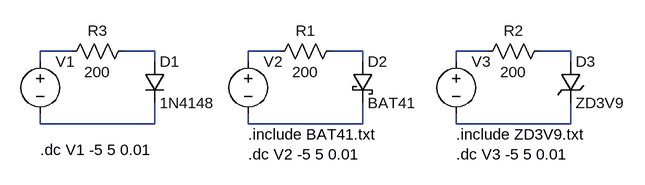
[diagram p0: schematic 121_BAT41.asc]
121_BAT41.asc, the LTspice schematic file:
Version 4
SHEET 1 880 680
WIRE -128 176 -176 176
WIRE 0 176 -48 176
WIRE 192 176 144 176
WIRE 320 176 272 176
WIRE 512 176 464 176
WIRE 640 176 592 176
WIRE -176 192 -176 176
WIRE 0 192 0 176
WIRE 144 192 144 176
WIRE 320 192 320 176
WIRE 464 192 464 176
WIRE 640 192 640 176
WIRE -176 288 -176 272
WIRE 0 288 0 256
WIRE 0 288 -176 288
WIRE 144 288 144 272
WIRE 320 288 320 256
WIRE 320 288 144 288
WIRE 464 288 464 272
WIRE 640 288 640 256
WIRE 640 288 464 288
SYMBOL voltage 144 176 R0
SYMATTR InstName V2
SYMATTR Value ""
SYMBOL Res 288 160 R90
WINDOW 0 0 56 VBottom 2
WINDOW 3 32 56 VTop 2
SYMATTR InstName R1
SYMATTR Value 200
SYMBOL schottky 304 192 R0
SYMATTR InstName D2
SYMATTR Value BAT41
SYMBOL voltage 464 176 R0
SYMATTR InstName V3
SYMATTR Value ""
SYMBOL Res 608 160 R90
WINDOW 0 0 56 VBottom 2
WINDOW 3 32 56 VTop 2
SYMATTR InstName R2
SYMATTR Value 200
SYMBOL zener 624 192 R0
SYMATTR InstName D3
SYMATTR Value ZD3V9
SYMATTR Description Schottky diode
SYMATTR Type schottky
SYMBOL voltage -176 176 R0
SYMATTR InstName V1
SYMATTR Value ""
SYMBOL Res -32 160 R90
WINDOW 0 0 56 VBottom 2
WINDOW 3 32 56 VTop 2
SYMATTR InstName R3
SYMATTR Value 200
SYMBOL diode -16 192 R0
SYMATTR InstName D1
SYMATTR Value 1N4148
SYMATTR Description Schottky diode
SYMATTR Type schottky
TEXT 144 304 Left 2 !.include BAT41.txt\n.dc V2 -5 5 0.01
TEXT 464 304 Left 2 !.include ZD3V9.txt\n.dc V3 -5 5 0.01
TEXT -176 328 Left 2 !.dc V1 -5 5 0.01

The netlist it stands for:
* 121_BAT41.asc
V2 N003 N008
R1 N004 N003 200
D2 N004 N008 BAT41
V3 N005 N009
R2 N006 N005 200
D3 N006 N009 ZD3V9
V1 N001 N007
R3 N002 N001 200
D1 N002 N007 1N4148
.model D D
.lib standard.dio
.include BAT41.txt
.dc V2 -5 5 0.01
.include ZD3V9.txt
.dc V3 -5 5 0.01
.dc V1 -5 5 0.01
.backanno
.end